# Altium schematic sheet H750Common6.SchDoc
size A3
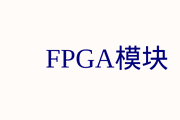
[diagram p0: H750Common6.SchDoc]

## Notes on the sheet
- FPGA模块